# EAGLE design ina125pLoadCell (EAGLE 7.5.0)
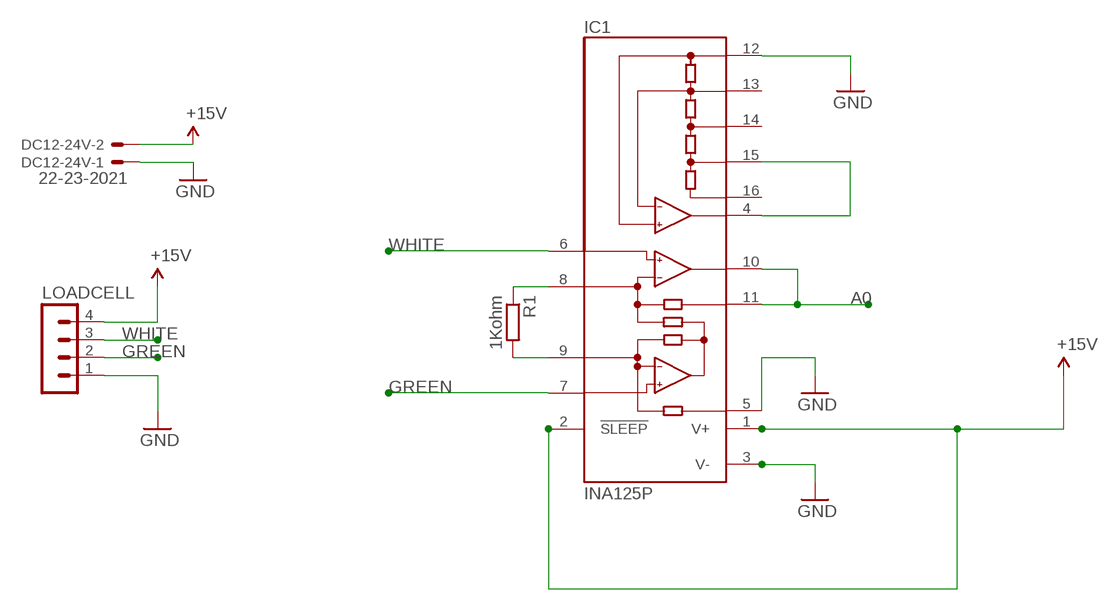
[diagram p0: schematic, sheet 1]

## Parts
DC12-24V  22-23-2021  [22-23-2021]
IC1  INA125P  [DIL16]
LOADCELL  MA04-1  [MA04-1]
R1  1Kohm  R-EU_0207/7  [0207/7]

## Nets
+15V: IC1.1(V+) IC1.2(!SLEEP)
A0: IC1.10(OUT) IC1.11(SENSE)
AREF: IC1.4(REFOUT) IC1.15(REF5)
GND: DC12-24V.1 IC1.3(V-) IC1.5(REF) IC1.12(REFCOM) LOADCELL.1
GREEN: IC1.7(-IN) LOADCELL.2
N$2: IC1.9(RG) R1.2
N$3: IC1.8(RG) R1.1
VCC: DC12-24V.2 LOADCELL.4 ; supply symbol labelled +15V
WHITE: IC1.6(+IN) LOADCELL.3
Unconnected: IC1.13(REFBG) IC1.14(REF2.5) IC1.16(REF10)

## Library data of the parts
DC12-24V = con-molex:22-23-2021: .100" (2.54mm) Center Header - 2 Pin; MF: MOLEX; MPN: 22-23-2021; OC_FARNELL: 1462926; OC_NEWARK: 25C3832
IC1 = burr-brown:INA125: Instrumentation Amplifier with Precision Voltage Reference; MF: TEXAS INSTRUMENT CONNECTORS; MPN: INA125P; OC_FARNELL: 1459461; OC_NEWARK: 35C1726
LOADCELL = con-lstb:MA04-1: PIN HEADER; OC_FARNELL: unknown; OC_NEWARK: unknown
R1 = rcl:R-EU_: RESISTOR, European symbol

## Board
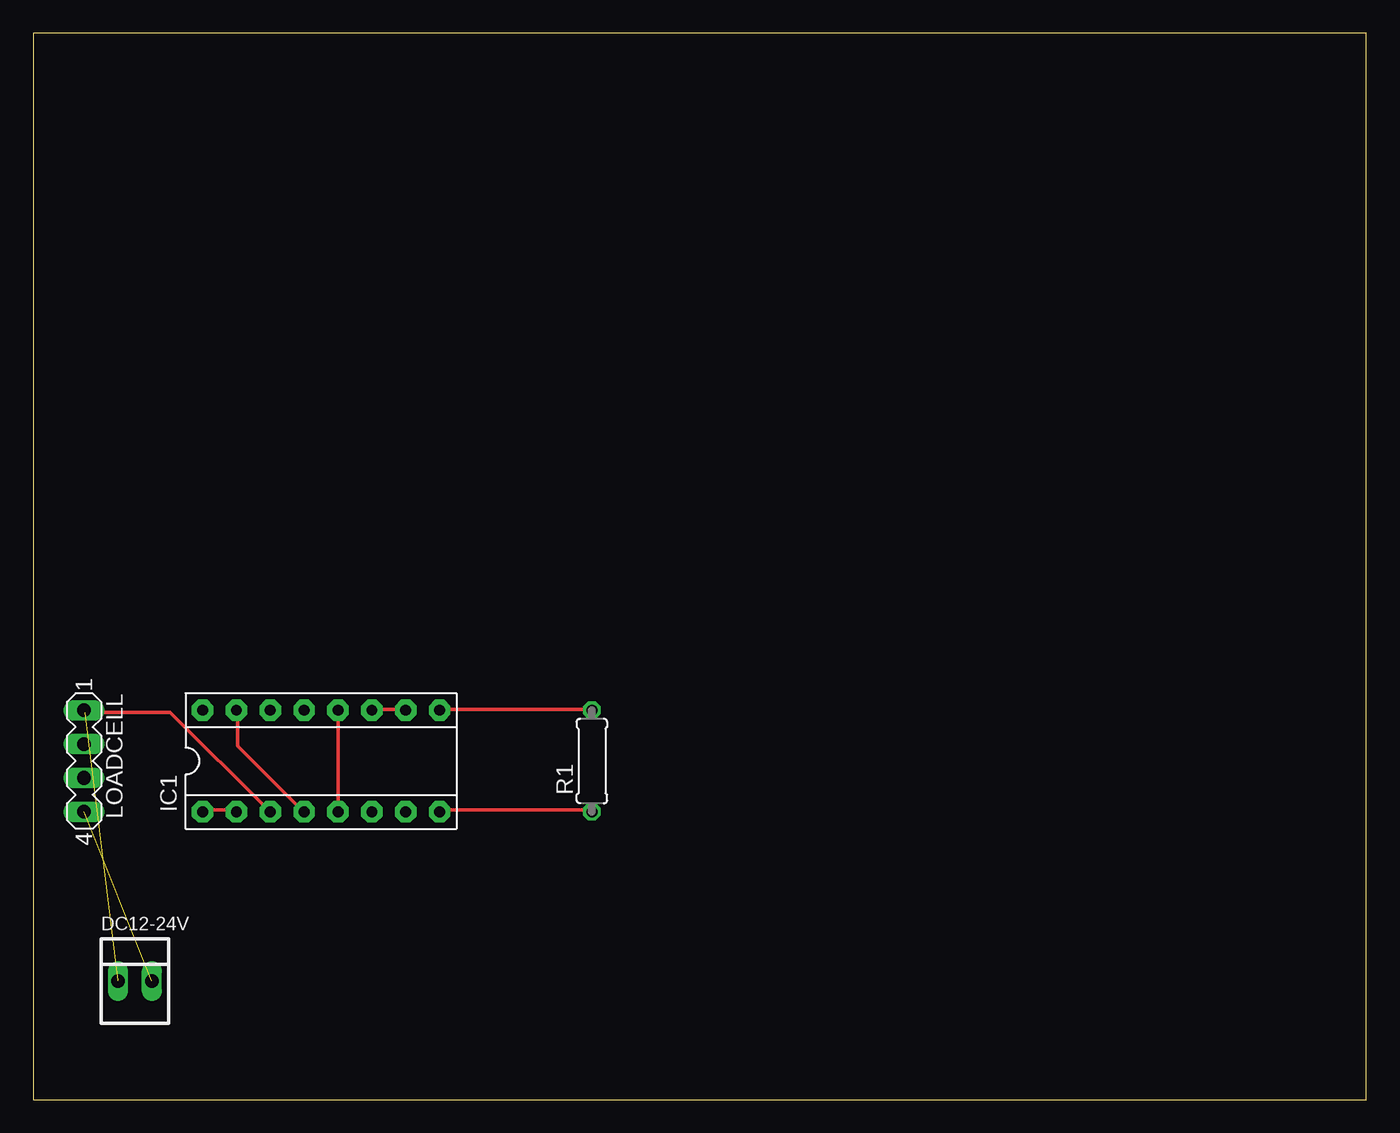
[diagram p1: board, top side]
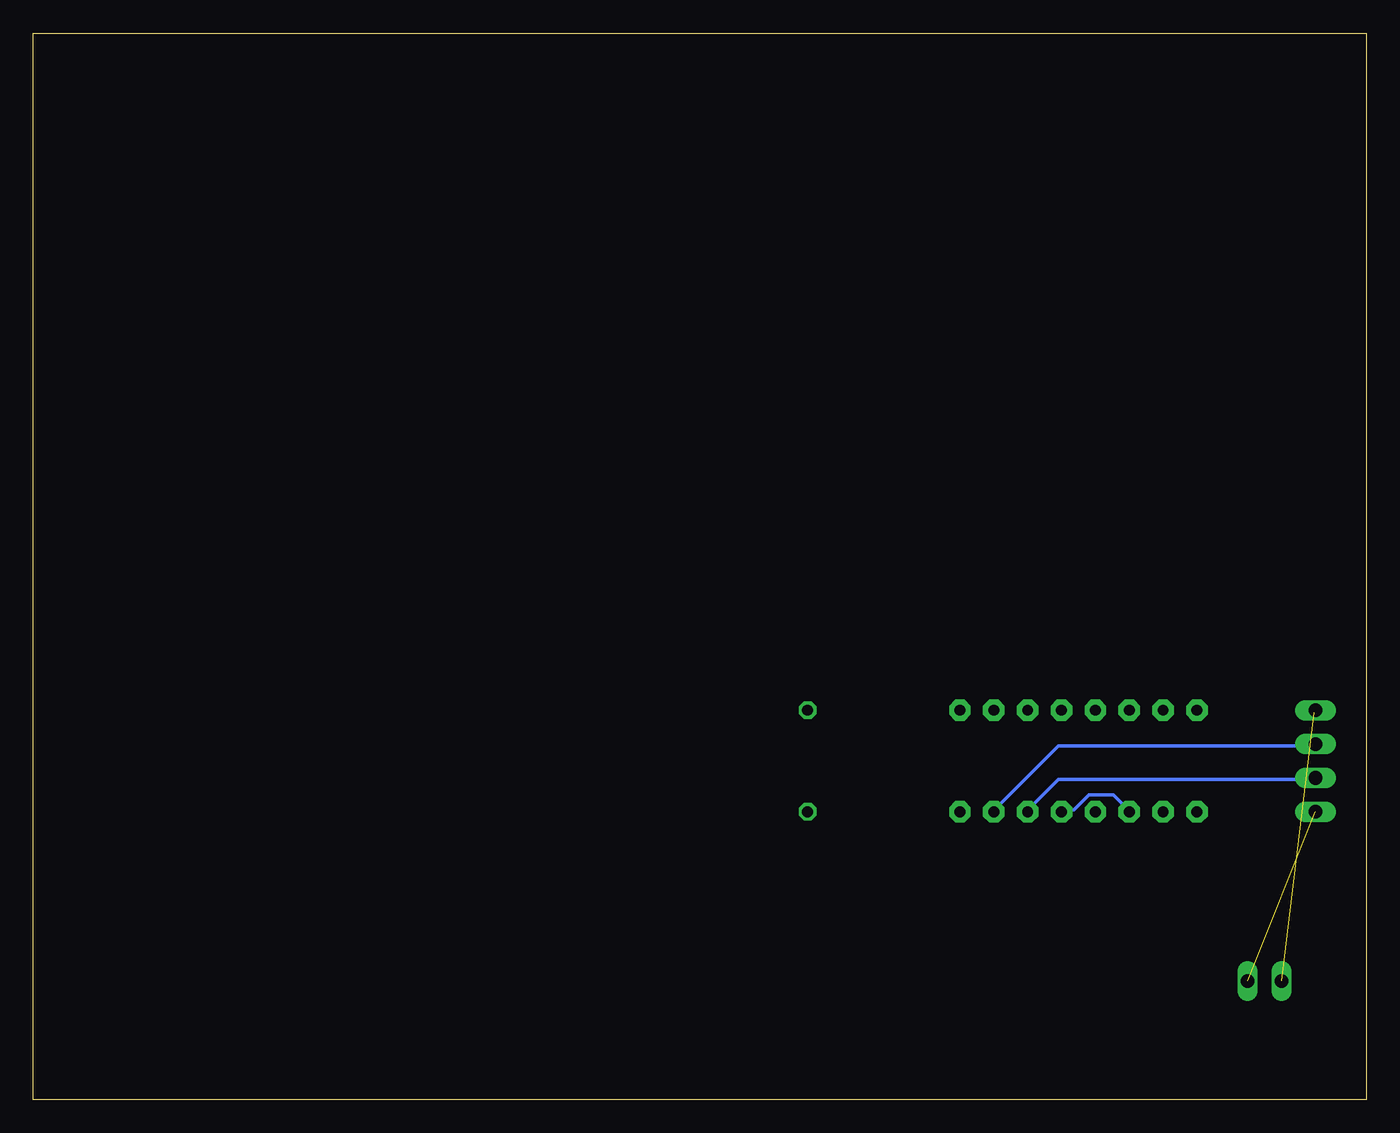
[diagram p2: board, bottom side, seen from below]

Size 100 x 80 mm. Coordinates in mm from the lower left corner, seen from the top.
Outline: 0,0 100,0 100,80 0,80 0,0
Copper layers (1*16): Top 0.035mm / dielectric 1.5mm / Bottom 0.035mm
Design rules "default": minimum track width 10mil, minimum drill 24mil, track to track 8mil, track to pad 8mil, pad to pad 8mil, via to via 8mil, smd to smd 8mil, copper to edge 40mil, drill to drill 8mil, minimum pad ring 10mil, minimum via ring 8mil, stop-mask expansion 4mil, vias tented up to drill 0mil, thermal gap 10mil

### Footprints (pad centres in the part's own frame; a part is rotated, then mirrored left to right if it is on the bottom)
22-23-2021 = drill 1 long: 1 -1.27,0; 2 1.27,0
DIL16 = drill 0.813 pad 1.6 octagon: 1 -8.89,-3.81; 2 -6.35,-3.81; 3 -3.81,-3.81; 4 -1.27,-3.81; 5 1.27,-3.81; 6 3.81,-3.81; 7 6.35,-3.81; 8 8.89,-3.81; 9 8.89,3.81; 10 6.35,3.81; 11 3.81,3.81; 12 1.27,3.81; 13 -1.27,3.81; 14 -3.81,3.81; 15 -6.35,3.81; 16 -8.89,3.81
MA04-1 = drill 1.016 long: 1 -3.81,0; 2 -1.27,0; 3 1.27,0; 4 3.81,0
0207/7 = drill 0.813 octagon: 1 -3.81,0; 2 3.81,0

### Placement (x,y rotation side)
DC12-24V  7.62,8.89 0 top
IC1  21.59,25.4 0 top
LOADCELL  3.81,25.4 270 top
R1  41.91,25.4 90 top

### Tracks (layer width: path | path; a pad name or v marks a point on that pad's centre or on a via)
+15V
  Top 0.254: IC1.1 12.8,21.72 15.09,21.72 IC1.2
A0
  Top 0.254: IC1.11 25.6,29.26 27.89,29.26 IC1.10
AREF
  Top 0.254: IC1.15 15.32,29.03 15.32,26.52 20.12,21.72 IC1.4
GND  (1 unrouted)
  Top 0.254: LOADCELL.1 3.89,29.03 10.29,29.03 17.6,21.72 IC1.3 | IC1.5 IC1.12
  Bottom 0.254: IC1.5 22.86,21.72 21.95,21.72 20.8,22.86 18.97,22.86 17.83,21.72 IC1.3
GREEN
  Bottom 0.254: LOADCELL.2 3.89,26.52 23.09,26.52 27.89,21.72 IC1.7
N$2
  Top 0.254: R1.2 41.83,29.26 30.63,29.26 IC1.9
N$3
  Top 0.254: R1.1 41.83,21.72 30.63,21.72 IC1.8
VCC  (1 unrouted)
WHITE
  Bottom 0.254: LOADCELL.3 3.89,24 23.09,24 25.38,21.72 IC1.6